# Altium project ldo-1.PrjPcb
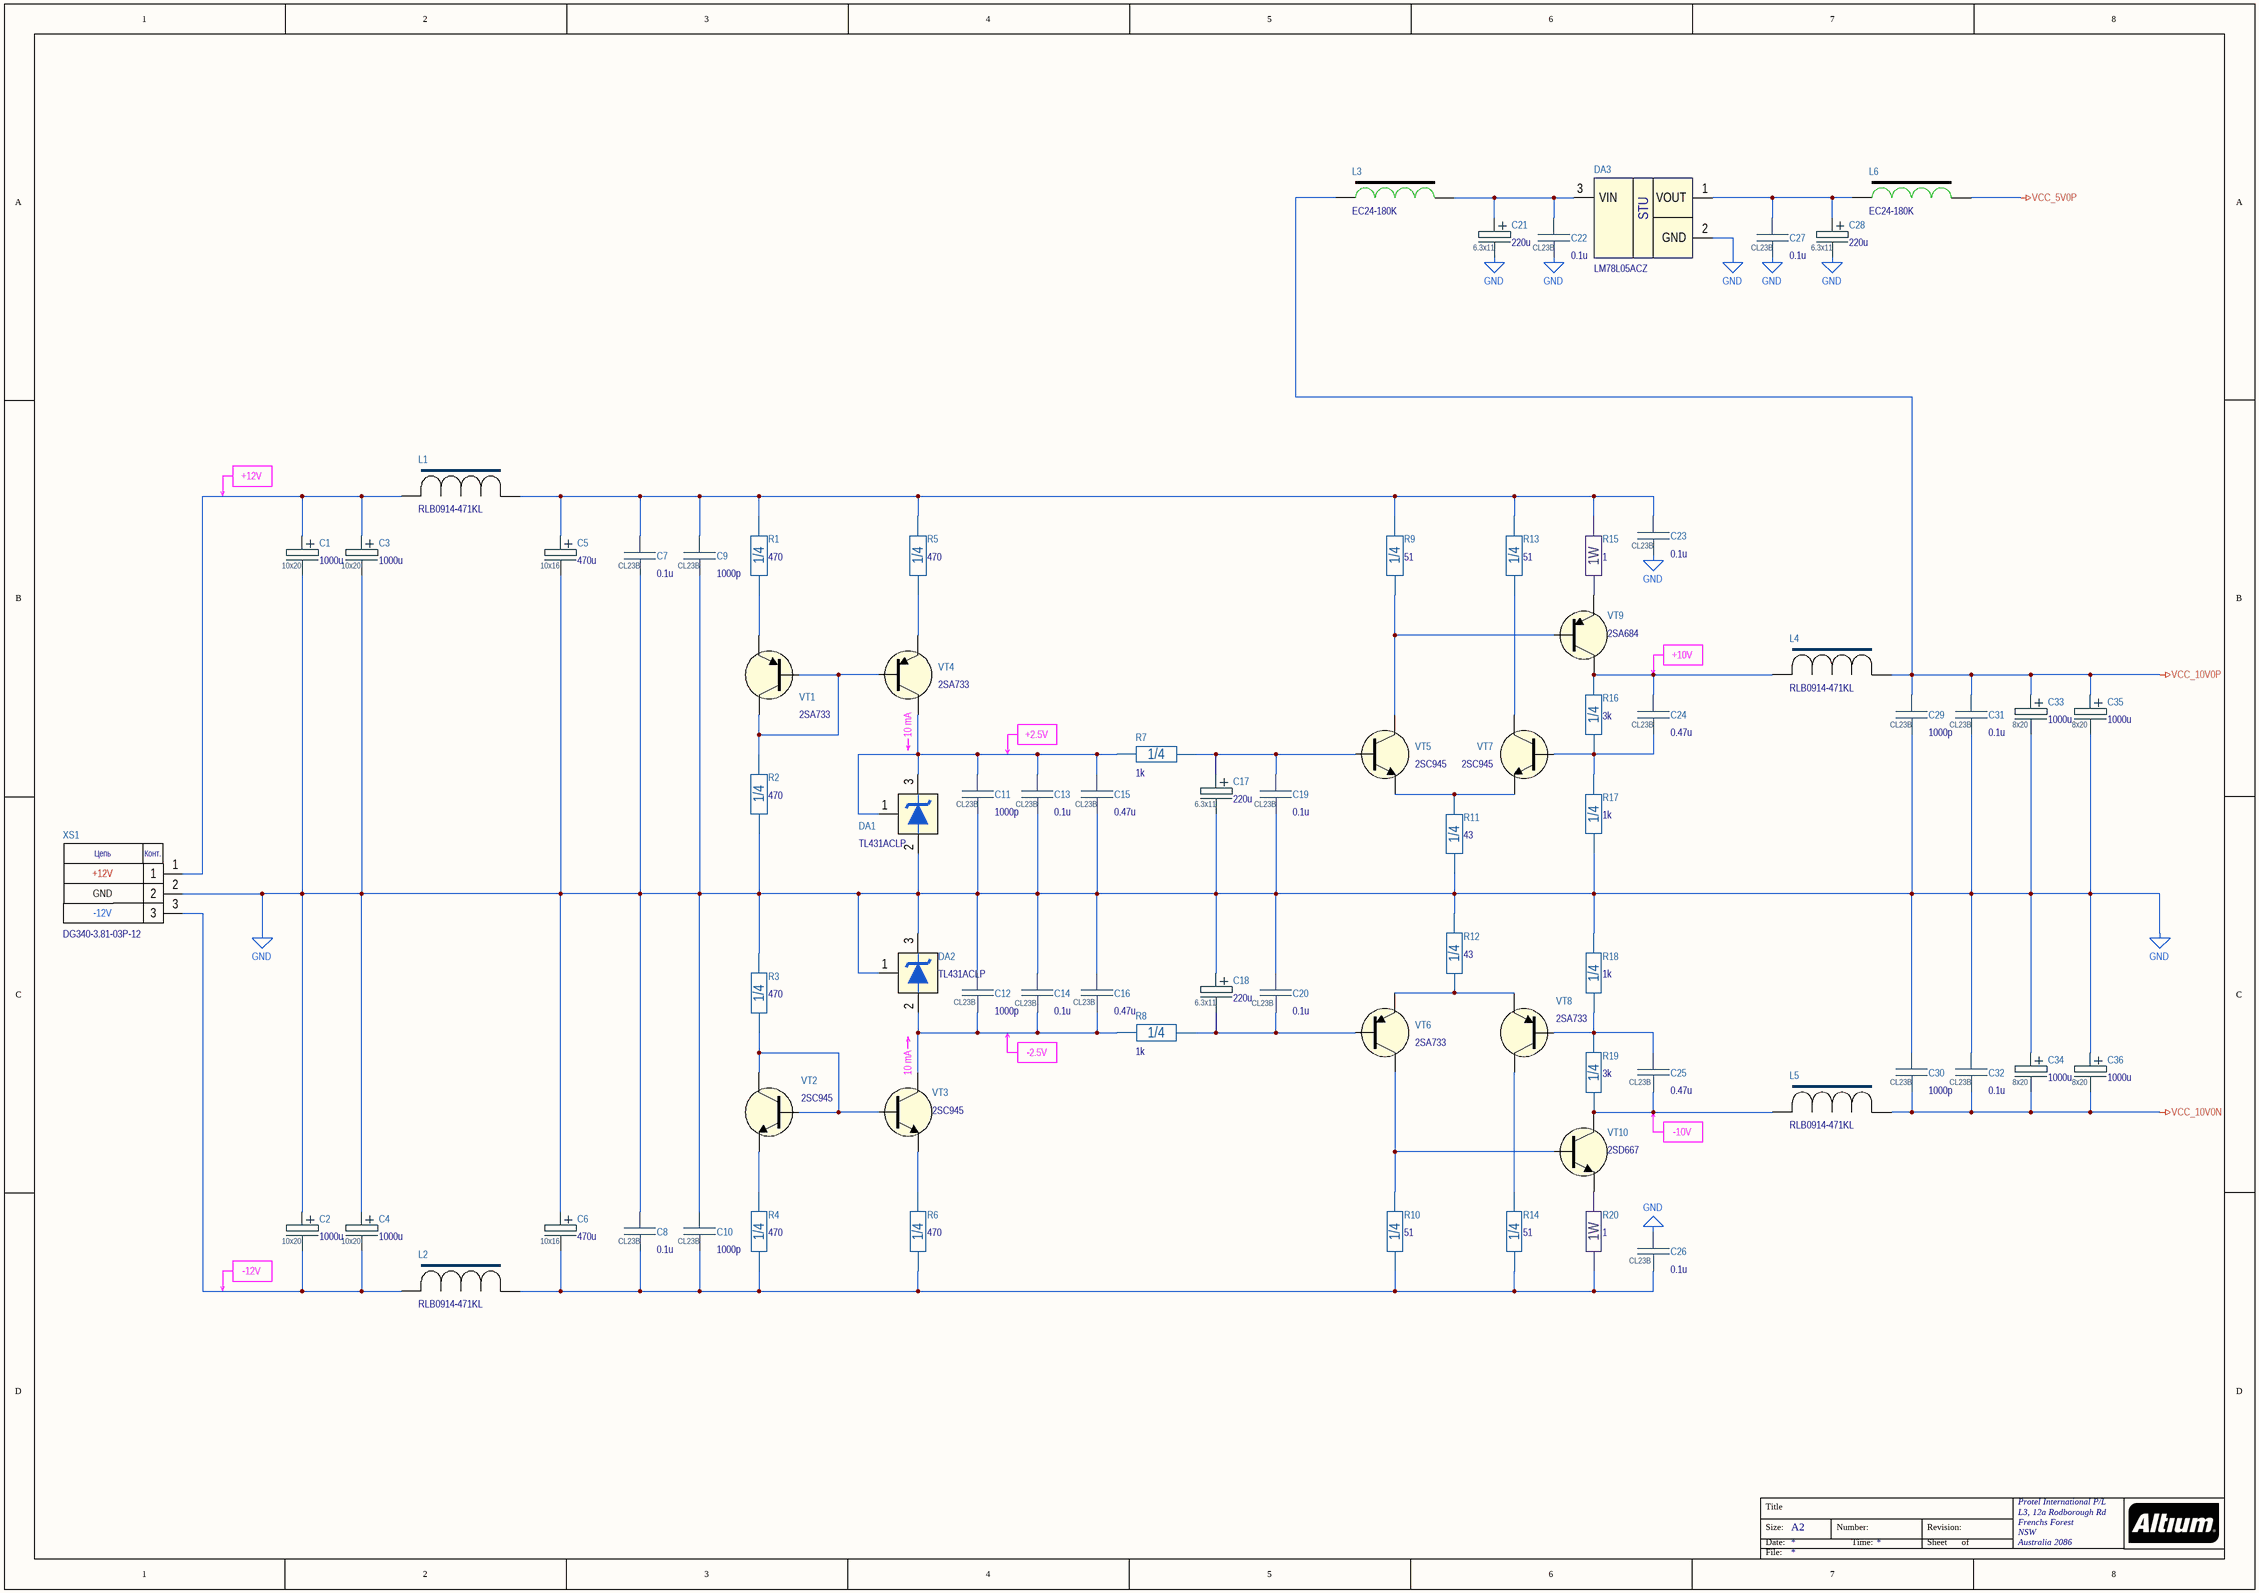
[diagram p0: p1_power_supply_10v.SchDoc]
2 sheets, 191 parts. Net scope: global (net labels, ports and power ports of the same name join across sheets).
Board file: ldo-1.PcbDoc
Sheets:
  p1_power_supply_10v.SchDoc
  p2_regulator.SchDoc

## Sheet p1_power_supply_10v.SchDoc
size A2; Organization: Protel International P/L; Address1: L3, 12a Rodborough Rd; Address2: Frenchs Forest; Address3: NSW; Address4: Australia 2086

### Parts
C1  1000u  Package: 10x20  [ECAP10X21X5_BRW]
C2  1000u  Package: 10x20  [ECAP10X21X5_BRW]
C3  1000u  Package: 10x20  [ECAP10X21X5_BRW]
C4  1000u  Package: 10x20  [ECAP10X21X5_BRW]
C5  470u  Package: 10x16  [ECAP10X17X5_BRW]
C6  470u  Package: 10x16  [ECAP10X17X5_BRW]
C7  0.1u  [CL23B_7.2x2.5]
C8  0.1u  [CL23B_7.2x2.5]
C9  1000p  [CL23B_7.2x2.5]
C10  1000p  [CL23B_7.2x2.5]
C11  1000p  [CL23B_7.2x2.5]
C12  1000p  [CL23B_7.2x2.5]
C13  0.1u  [CL23B_7.2x2.5]
C14  0.1u  [CL23B_7.2x2.5]
C15  0.47u  [CL23B_7.2x3.5]
C16  0.47u  [CL23B_7.2x3.5]
C17  220u  Package: 6.3x11  [ECAP6.3X11X2.5_BRW]
C18  220u  Package: 6.3x11  [ECAP6.3X11X2.5_BRW]
C19  0.1u  [CL23B_7.2x2.5]
C20  0.1u  [CL23B_7.2x2.5]
C21  220u  Package: 6.3x11  [ECAP6.3X11X2.5_BRW]
C22  0.1u  [CL23B_7.2x2.5]
C23  0.1u  [CL23B_7.2x2.5]
C24  0.47u  [CL23B_7.2x3.5]
C25  0.47u  [CL23B_7.2x3.5]
C26  0.1u  [CL23B_7.2x2.5]
C27  0.1u  [CL23B_7.2x2.5]
C28  220u  Package: 6.3x11  [ECAP6.3X11X2.5_BRW]
C29  1000p  [CL23B_7.2x2.5]
C30  1000p  [CL23B_7.2x2.5]
C31  0.1u  [CL23B_7.2x2.5]
C32  0.1u  [CL23B_7.2x2.5]
C33  1000u  Package: 8x20  [ECAP8X20X3.5_BRW]
C34  1000u  Package: 8x20  [ECAP8X20X3.5_BRW]
C35  1000u  Package: 8x20  [ECAP8X20X3.5_BRW]
C36  1000u  Package: 8x20  [ECAP8X20X3.5_BRW]
DA1  TL431ACLP  [TO-92 (VERTICAL,LINE)]
DA2  TL431ACLP  [TO-92 (VERTICAL,LINE)]
DA3  LM78L05ACZ  [TO-92 (VERTICAL,LINE)]
L1  RLB0914-471KL  [RLB0914]
L2  RLB0914-471KL  [RLB0914]
L3  EC24-180K  [EC24_GREEN]
L4  RLB0914-471KL  [RLB0914]
L5  RLB0914-471KL  [RLB0914]
L6  EC24-180K  [EC24_GREEN]
R1  470  Package: 1/4  [CFR-25]
R2  470  Package: 1/4  [CFR-25]
R3  470  Package: 1/4  [CFR-25]
R4  470  Package: 1/4  [CFR-25]
R5  470  Package: 1/4  [CFR-25]
R6  470  Package: 1/4  [CFR-25]
R7  1k  Package: 1/4  [CFR-25]
R8  1k  Package: 1/4  [CFR-25]
R9  51  Package: 1/4  [CFR-25]
R10  51  Package: 1/4  [CFR-25]
R11  43  Package: 1/4  [CFR-25]
R12  43  Package: 1/4  [CFR-25]
R13  51  Package: 1/4  [CFR-25]
R14  51  Package: 1/4  [CFR-25]
R15  1  Package: 1W  [CFR-100]
R16  3k  Package: 1/4  [CFR-25]
R17  1k  Package: 1/4  [CFR-25]
R18  1k  Package: 1/4  [CFR-25]
R19  3k  Package: 1/4  [CFR-25]
R20  1  Package: 1W  [CFR-100]
VT1  2SA733  [TO-92 (VERTICAL,LINE)]
VT2  2SC945  [TO-92 (VERTICAL,LINE)]
VT3  2SC945  [TO-92 (VERTICAL,LINE)]
VT4  2SA733  [TO-92 (VERTICAL,LINE)]
VT5  2SC945  [TO-92 (VERTICAL,LINE)]
VT6  2SA733  [TO-92 (VERTICAL,LINE)]
VT7  2SC945  [TO-92 (VERTICAL,LINE)]
VT8  2SA733  [TO-92 (VERTICAL,LINE)]
VT9  2SA684  [TO-92L (VERTICAL,LINE)]
VT10  2SD667  [TO-92L (VERTICAL,LINE)]
XS1  DG340-3.81-03P-12  [DG340-3.81-03P]

### Nets
GND: C1.2 C2.1 C3.2 C4.1 C5.2 C6.1 C7.2 C8.1 C9.2 C10.1 C11.2 C12.2 C13.2 C14.2 C15.2 C16.2 C17.2 C18.1 C19.2 C20.2 C21.2 C22.2 C23.2 C26.2 C27.2 C28.2 C29.2 C30.1 C31.2 C32.1 C33.2 C34.1 C35.2 C36.1 DA1.2(ANODE) DA2.1(REF) DA2.3(CATHODE) DA3.2(GND) R2.1 R3.1 R11.2 R12.2 R17.2 R18.2 XS1.2
VCC_5V0P: L6.2
VCC_10V0N: C30.2 C32.2 C34.2 C36.2 L5.2
VCC_10V0P: C29.1 C31.1 C33.1 C35.1 L3.1 L4.2
NetC1_1: C1.1 C3.1 L1.1 XS1.1
NetC2_2: C2.2 C4.2 L2.1 XS1.3
NetC5_1: C5.1 C7.1 C9.1 C23.1 L1.2 R1.2 R5.2 R9.2 R13.2 R15.2
NetC6_2: C6.2 C8.2 C10.2 C26.1 L2.2 R4.2 R6.2 R10.2 R14.2 R20.2
NetC11_1: C11.1 C13.1 C15.1 DA1.1(REF) DA1.3(CATHODE) R7.2 VT4.2(C)
NetC12_1: C12.1 C14.1 C16.1 DA2.2(ANODE) R8.2 VT3.2(C)
NetC17_1: C17.1 C19.1 R7.1 VT5.1(B)
NetC18_2: C18.2 C20.1 R8.1 VT6.1(B)
NetC21_1: C21.1 C22.1 DA3.3(VIN) L3.2
NetC24_1: C24.1 L4.1 R16.1 VT9.2(C)
NetC24_2: C24.2 R16.2 R17.1 VT7.1(B)
NetC25_1: C25.1 L5.1 R19.1 VT10.2(C)
NetC25_2: C25.2 R18.1 R19.2 VT8.1(B)
NetC27_1: C27.1 C28.1 DA3.1(VOUT) L6.1
NetR1_1: R1.1 VT1.3(E)
NetR2_2: R2.2 VT1.1(B) VT1.2(C) VT4.1(B)
NetR3_2: R3.2 VT2.1(B) VT2.2(C) VT3.1(B)
NetR4_1: R4.1 VT2.3(E)
NetR5_1: R5.1 VT4.3(E)
NetR6_1: R6.1 VT3.3(E)
NetR9_1: R9.1 VT5.2(C) VT9.3(B)
NetR10_1: R10.1 VT6.2(C) VT10.3(B)
NetR11_1: R11.1 VT5.3(E) VT7.3(E)
NetR12_1: R12.1 VT6.3(E) VT8.3(E)
NetR13_1: R13.1 VT7.2(C)
NetR14_1: R14.1 VT8.2(C)
NetR15_1: R15.1 VT9.1(E)
NetR20_1: R20.1 VT10.1(E)

### Notes on the sheet
- +12V
- +10V
- (near VT4) 10 mA
- +2.5V
- GND
- -12V
- -2.5V
- (near VT3) 10 mA
- -10V
- Title
- Size:
- Date:
- File:
- A2
- Number:
- Time:
- Revision:
- Sheet
- of
- (in symbol DG340-3.81-03P-12) Цепь; Конт.
- (in symbol LM78L05ACZ) STU

### Library data of the parts
C1-C4 = C_ECAP: Aluminium capacitor; Part Number: UVZ1E102MPD; Manufacturer: Nichicon; Tolerance: ± 20 %; Voltage: 25V; Value: 1000u; Value on schem: 1000u
C5 C6 = C_ECAP: Aluminium capacitor; Part Number: UPW1E471MPD; Manufacturer: Nichicon; Tolerance: ± 20 %; Voltage: 25V; Value: 470u; Value on schem: 470u
C7-C16 C19 C20 C22-C27 C29-C32 = CL23B: Box-type metallized polyester film capacitor; Tolerance: ± * %; Voltage: 63V; Dielectric: Polyester; Part Number: *; Manufacturer: *; Package: CL23B
  C7 C8 C13 C14 C19 C20 C22 C23 C26 C27 C31 C32: Value: 0.1u; Value on schem: 0.1u
  C9-C12 C29 C30: Value: 1000p; Value on schem: 1000p
  C15 C16 C24 C25: Value: 0.47u; Value on schem: 0.47u
C17 C18 C21 C28 = C_ECAP: Aluminium capacitor; Part Number: EKZH160ELL221MF11D; Manufacturer: Nichicon; Tolerance: ± 20 %; Voltage: 16V; Value: 220u; Value on schem: 220u
C33-C36 = C_ECAP: Aluminium capacitor; Part Number: UHV1C102MPD6; Manufacturer: Nichicon; Tolerance: ± 20 %; Voltage: 16V; Value: 1000u; Value on schem: 1000u
DA1 DA2 = TL431ACLP: Precision Programmable Reference; Manufacturer: Texas Instruments; Part Number: TL431ACLP; Package: TO-92
DA3 = LM78L05ACZ: 100-mA Fixed Output Linear Regulator; Manufacturer: Texas Instruments; Part Number: LM78L05ACZ; Package: TO-92
L1 L2 L4 L5 = RLB0914: Radial Inductors; Manufacturer: Bourns Inc.; RDC: 1.3 Ohm; SRF Min: 1.8 MHz; Q: 20; Irms  Max: 0.56 A; Isat  Typ: 1.0 A; Inductance @ 100 kHz: 470 µH; Part Number: RLB0914-471KL; Package: 8.7x12mm
L3 L6 = EC24: Axial leaded coated inductors; Manufacturer: 3L Electronic; RDC: 1 Ohm; SRF Min: 15 MHz; Q: 40; Irms  Max: 315 mA; Inductance @ 100 kHz: 18 µH; Part Number: EC24-180K; Package: EC24
R1-R6 = CF25: Resistor 1/4W; Part Number: MFP-25BRD52-470R; Manufacturer: Yageo; Tolerance: ± 0.1 %; Voltage: 250V; Temperature Coefficient: ±20 ppm/°C; Value: 470; Value on schem: 470
R7 R8 R17 R18 = CF25: Resistor 1/4W; Part Number: MFR-25FTF52-10K; Manufacturer: Yageo; Tolerance: ± 1 %; Voltage: 250V; Temperature Coefficient: ±100 ppm/°C; Value: 1k; Value on schem: 1k
R9 R10 R13 R14 = CF25: Resistor 1/4W; Part Number: MFP-25BRD52-51R; Manufacturer: Yageo; Tolerance: ± 0.1 %; Voltage: 250V; Temperature Coefficient: ±20 ppm/°C; Value: 51; Value on schem: 51
R11 R12 = CF25: Resistor 1/4W; Part Number: MFR-25FTF52-43R; Manufacturer: Yageo; Tolerance: ± 1 %; Voltage: 250V; Temperature Coefficient: ±100 ppm/°C; Value: 43; Value on schem: 43
R15 R20 = CF100: Resistor 1W; Part Number: KNP100FB-73-1R; Manufacturer: Yageo; Tolerance: ± 1 %; Voltage: 250V; Temperature Coefficient: ±200 ppm/°C; Value: 1; Value on schem: 1
R16 R19 = CF25: Resistor 1/4W; Part Number: MFR-25FTF52-3K; Manufacturer: Yageo; Tolerance: ± 1 %; Voltage: 250V; Temperature Coefficient: ±100 ppm/°C; Value: 3k; Value on schem: 3k
VT1 VT4 VT6 VT8 = 2SA733: General Purpose p-n-p Transistors; Manufacturer: NEC; Package: TO-92; Part Number: 2SA733
VT2 VT3 VT5 VT7 = 2SC945: General Purpose n-p-n Transistors; Manufacturer: NEC; Package: TO-92; Part Number: 2SC945
VT9 = 2SA684: General Purpose p-n-p Transistors -60V, -1A; Manufacturer: Secos; Package: TO-92L; Part Number: 2SA684
VT10 = 2SD667: General Purpose n-p-n Transistors 120V, 1A; Manufacturer: Secos; Package: TO-92L; Part Number: 2SD667
XS1 = DG340-3.81-03P-12: 3-way screw terminal, pitch 150mils (3.81mm); Manufacturer: DEGSON; Part Number: DG340-3.81-03P-12

## Sheet p2_regulator.SchDoc
size A1; Organization: Protel International P/L; Address1: L3, 12a Rodborough Rd; Address2: Frenchs Forest; Address3: NSW; Address4: Australia 2086
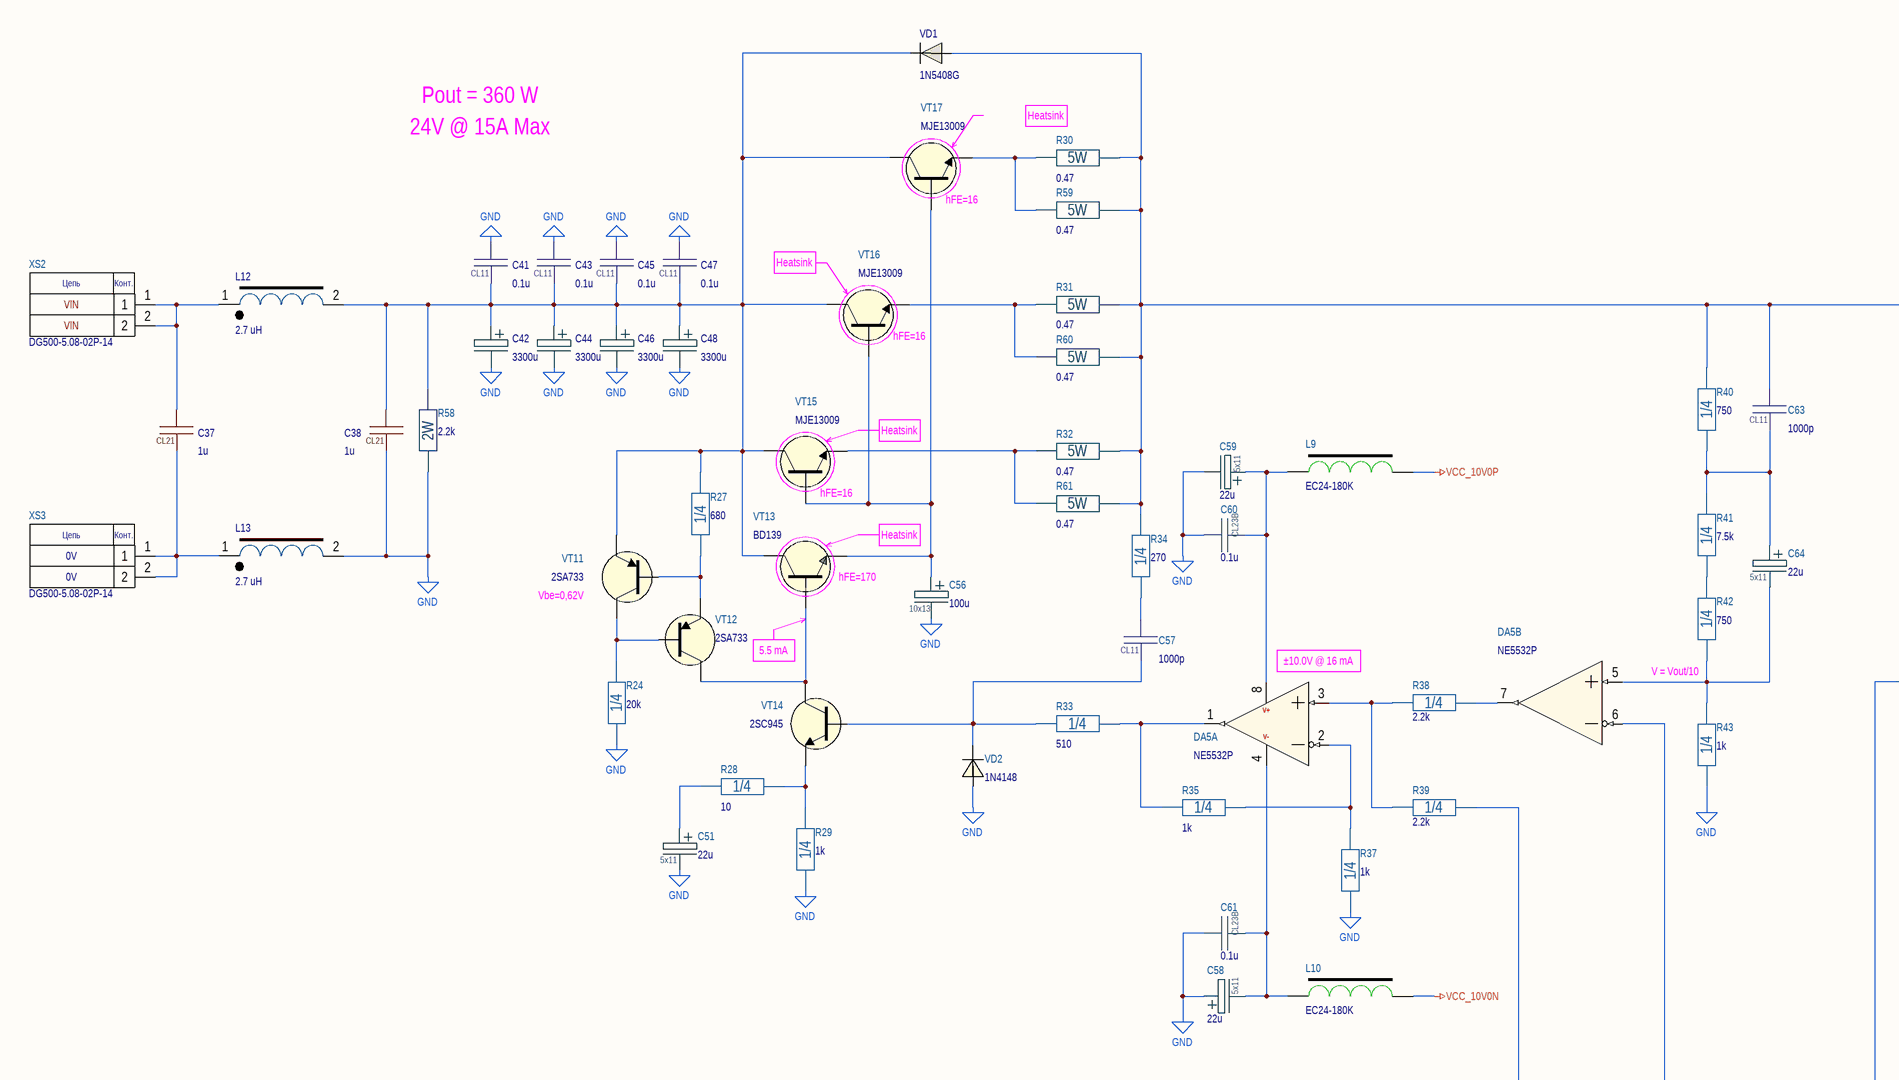
[diagram p1: p2_regulator.SchDoc, top left]
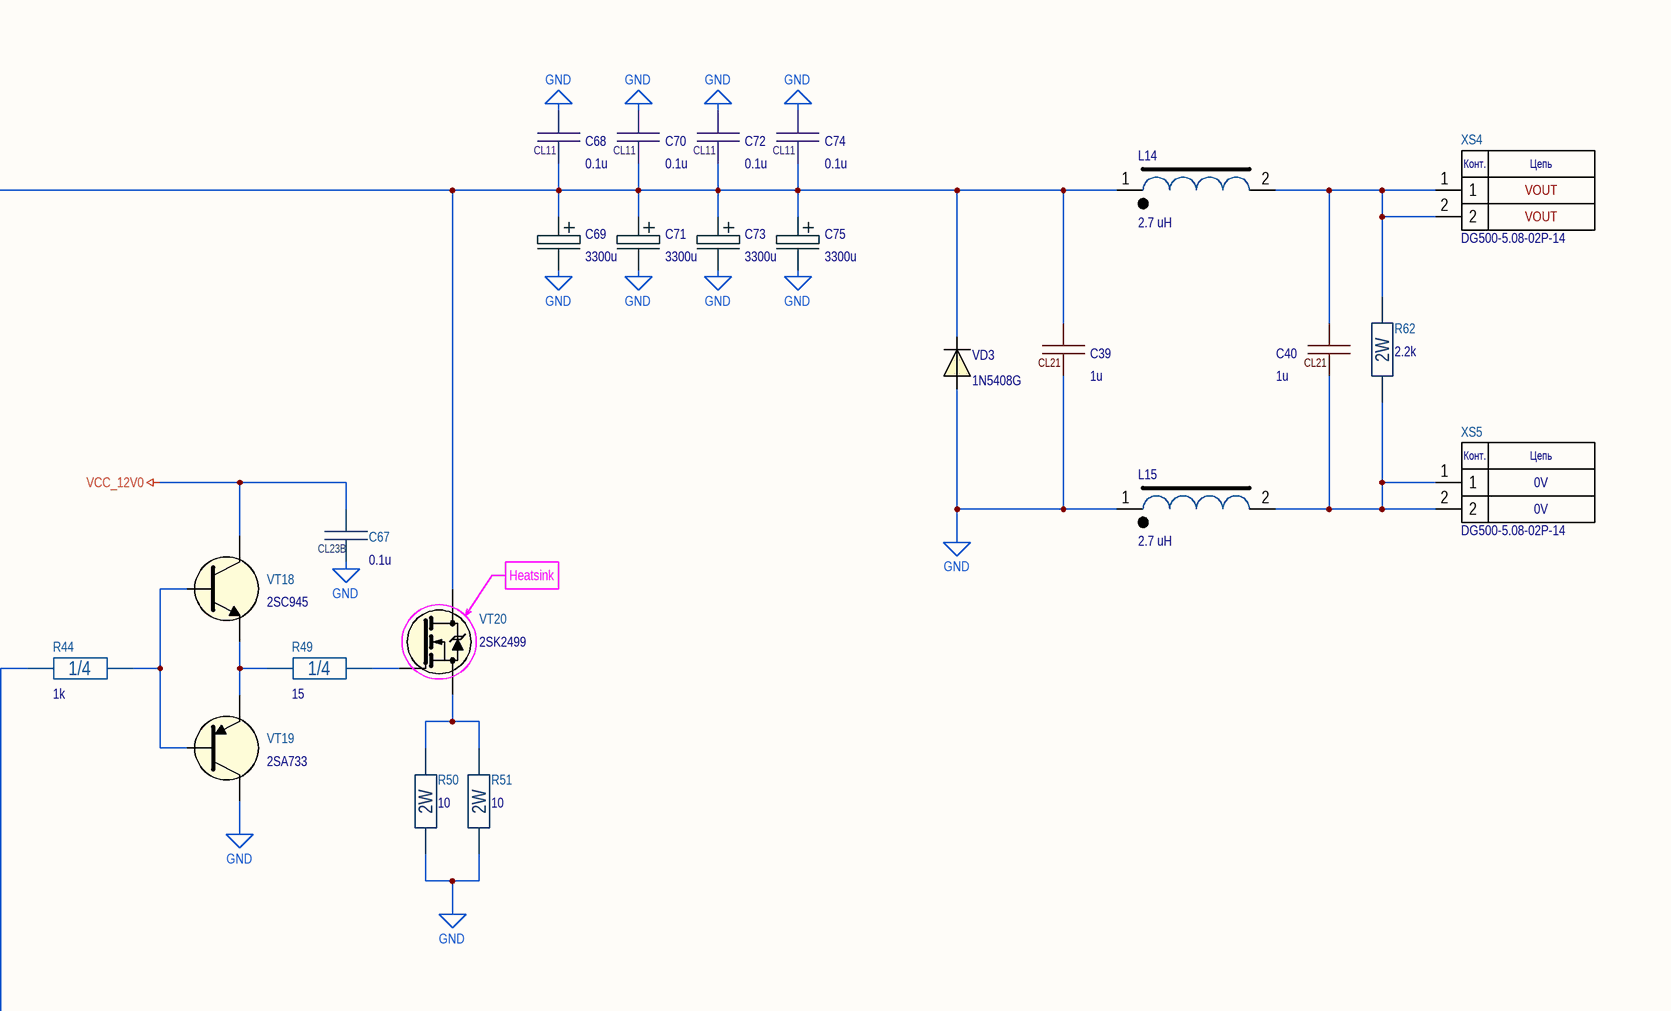
[diagram p2: p2_regulator.SchDoc, top right]
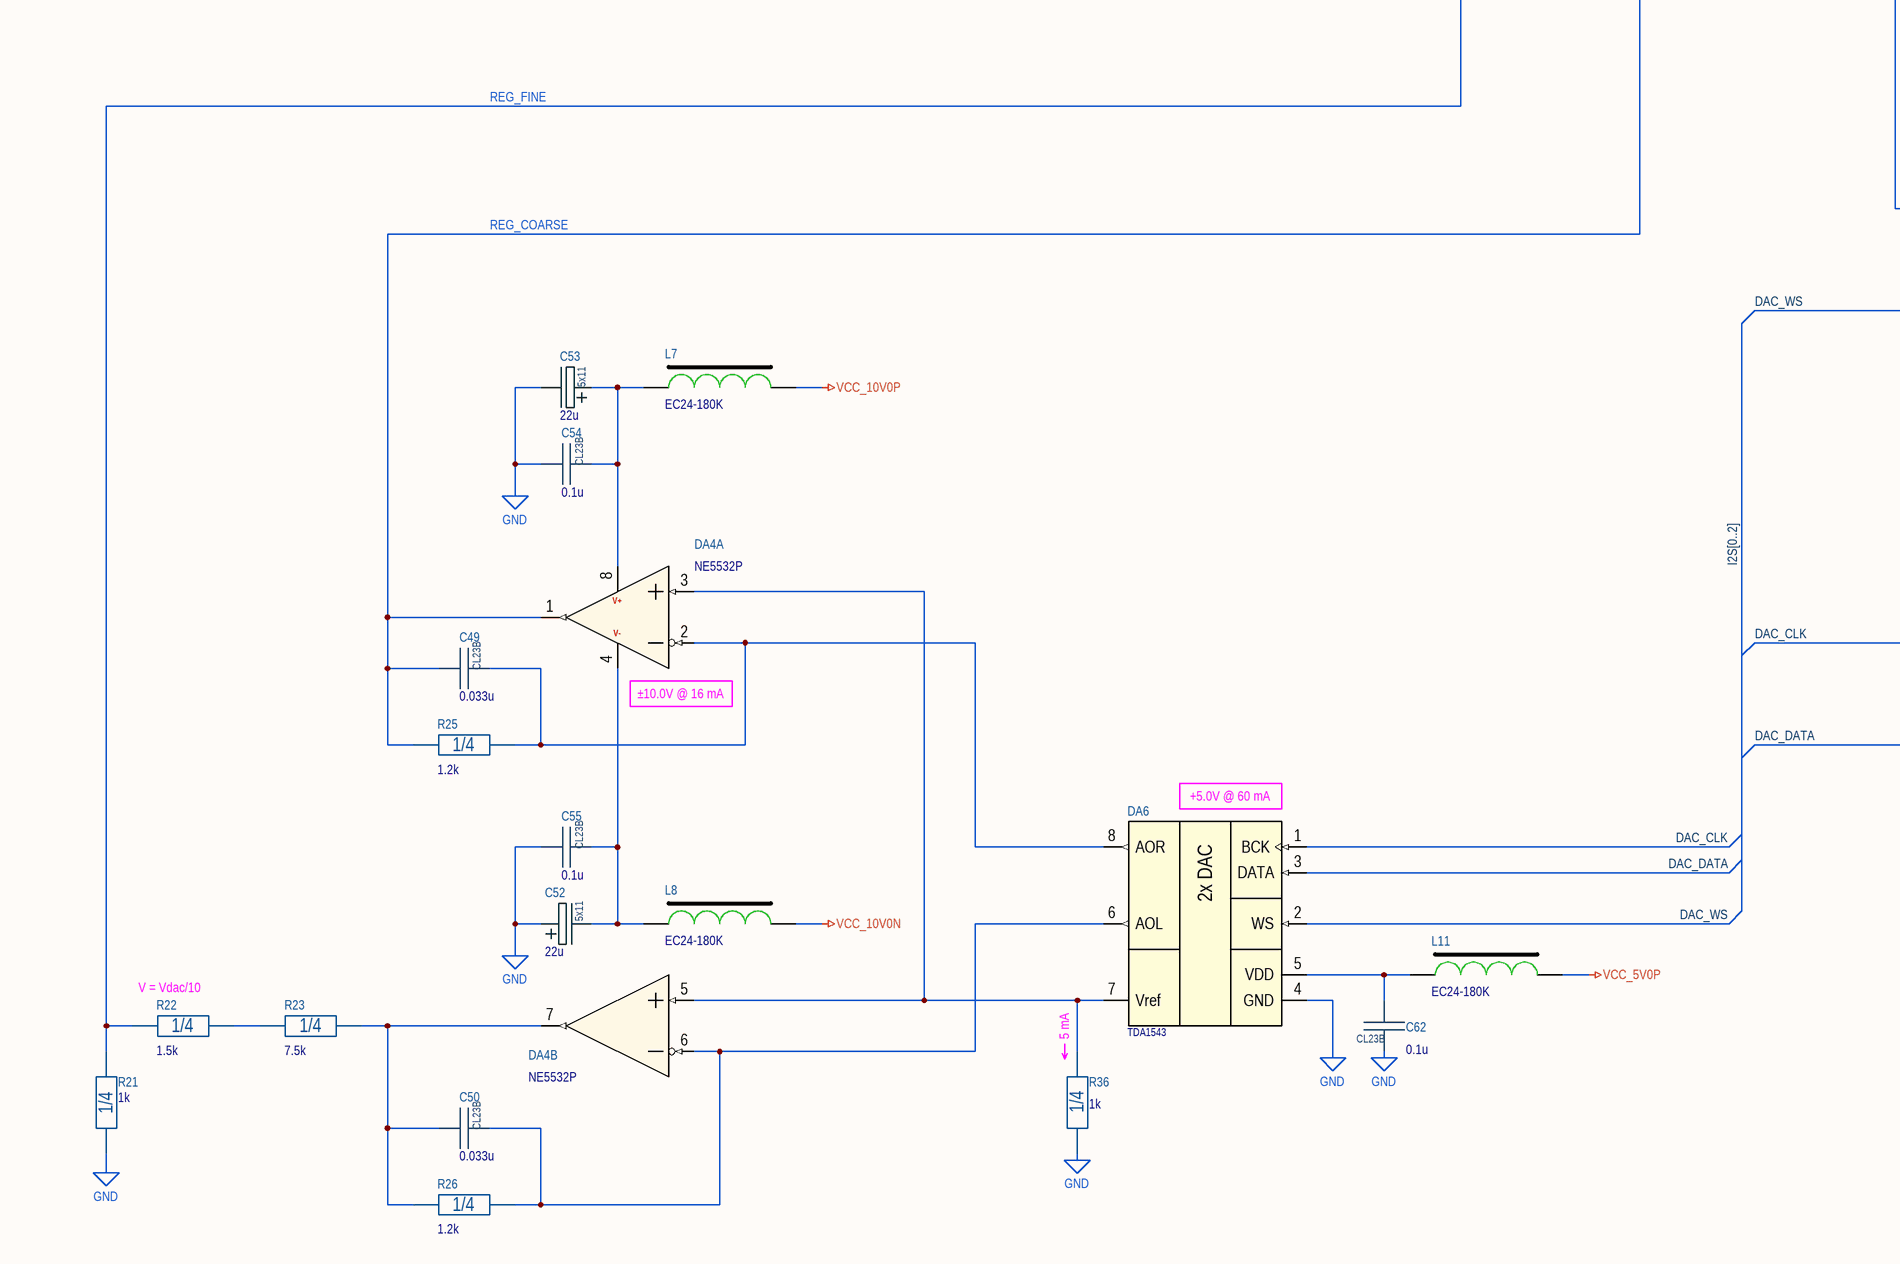
[diagram p3: p2_regulator.SchDoc, bottom left]
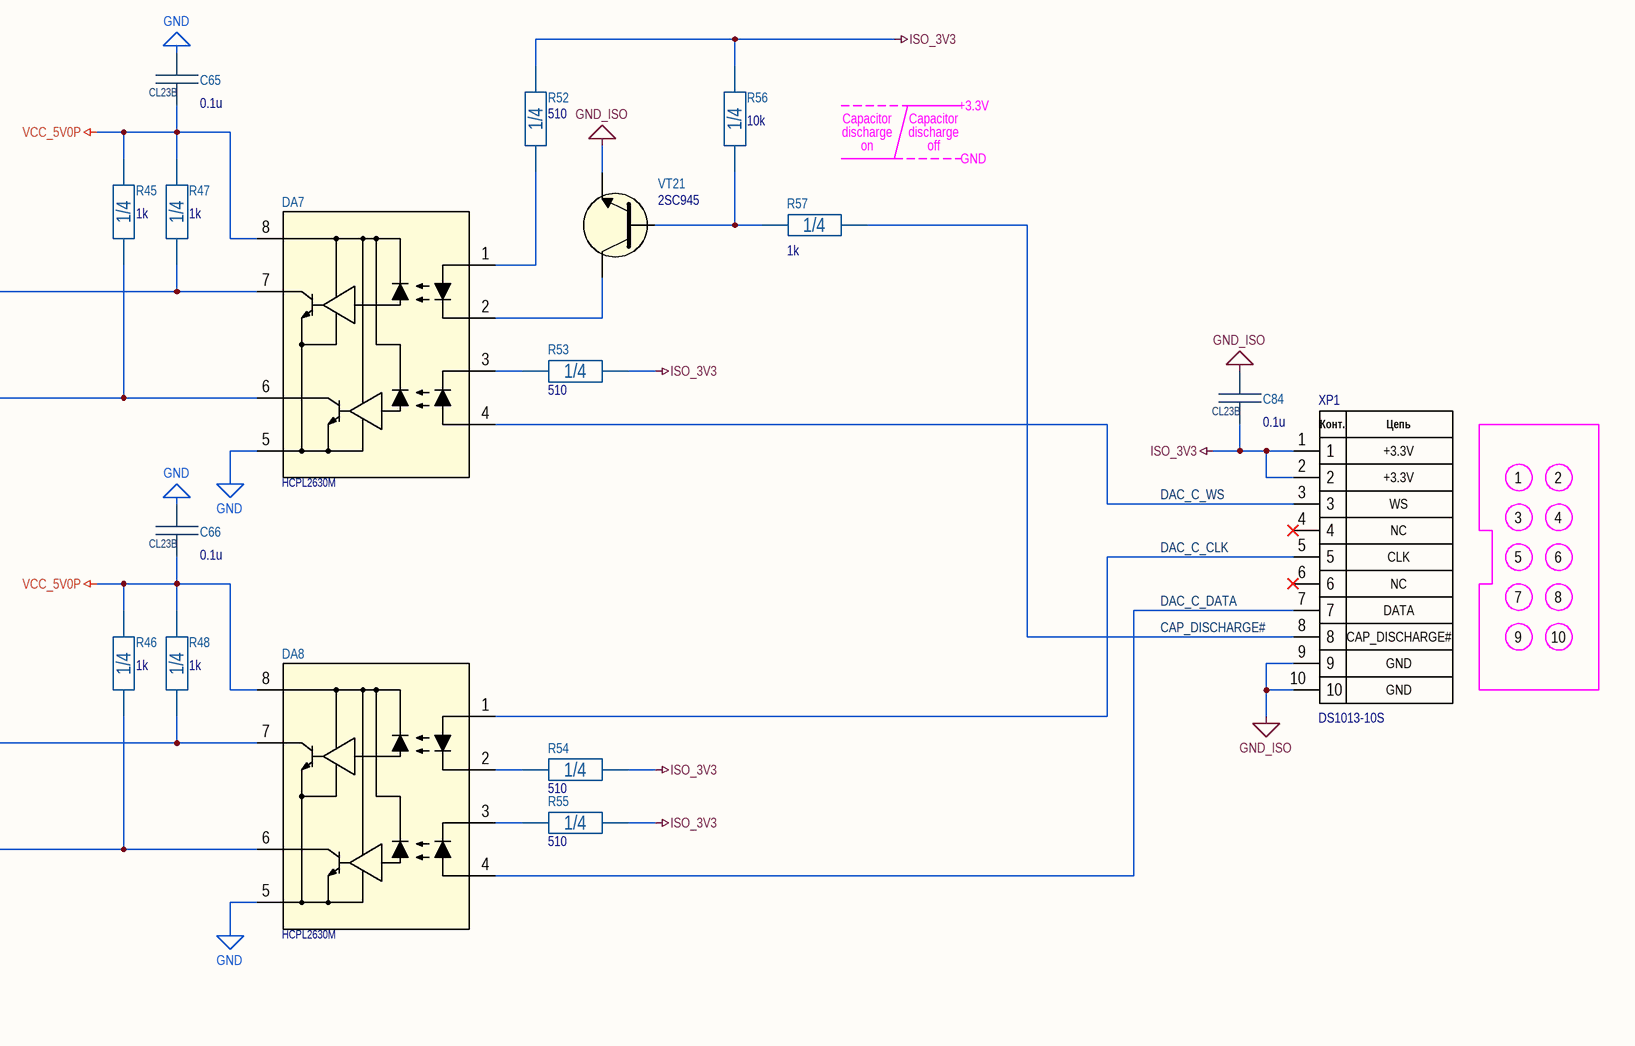
[diagram p4: p2_regulator.SchDoc, bottom right]

### Parts
C37  1u  [CL21_29x13.5x6.5_P27.5]
C38  1u  [CL21_29x13.5x6.5_P27.5]
C39  1u  [CL21_29x13.5x6.5_P27.5]
C40  1u  [CL21_29x13.5x6.5_P27.5]
C41  0.1u  [CL11_11.5x7_P7.5]
C42  3300u  [ECAP16X36X75_BLK]
C43  0.1u  [CL11_11.5x7_P7.5]
C44  3300u  [ECAP16X36X75_BLK]
C45  0.1u  [CL11_11.5x7_P7.5]
C46  3300u  [ECAP16X36X75_BLK]
C47  0.1u  [CL11_11.5x7_P7.5]
C48  3300u  [ECAP16X36X75_BLK]
C49  0.033u  [CL23B_7.2x2.5]
C50  0.033u  [CL23B_7.2x2.5]
C51  22u  Package: 5x11  [ECAP5X11X2.0_BRW]
C52  22u  Package: 5x11  [ECAP5X11X2.0_BRW]
C53  22u  Package: 5x11  [ECAP5X11X2.0_BRW]
C54  0.1u  [CL23B_7.2x2.5]
C55  0.1u  [CL23B_7.2x2.5]
C56  100u  Package: 10x13  [ECAP10X13X5_BRW]
C57  1000p  [CL11_6x3.5_P3.5]
C58  22u  Package: 5x11  [ECAP5X11X2.0_BRW]
C59  22u  Package: 5x11  [ECAP5X11X2.0_BRW]
C60  0.1u  [CL23B_7.2x2.5]
C61  0.1u  [CL23B_7.2x2.5]
C62  0.1u  [CL23B_7.2x2.5]
C63  1000p  [CL11_6x3.5_P3.5]
C64  22u  Package: 5x11  [ECAP5X11X2.0_BRW]
C65  0.1u  [CL23B_7.2x2.5]
C66  0.1u  [CL23B_7.2x2.5]
C67  0.1u  [CL23B_7.2x2.5]
C68  0.1u  [CL11_11.5x7_P7.5]
C69  3300u  [ECAP16X36X75_BLK]
C70  0.1u  [CL11_11.5x7_P7.5]
C71  3300u  [ECAP16X36X75_BLK]
C72  0.1u  [CL11_11.5x7_P7.5]
C73  3300u  [ECAP16X36X75_BLK]
C74  0.1u  [CL11_11.5x7_P7.5]
C75  3300u  [ECAP16X36X75_BLK]
C84  0.1u  [CL23B_7.2x2.5]
DA4  NE5532P  [DIP-8P-M01_with_SO8]  (parts A,B of 2)
DA5  NE5532P  [DIP-8P-M01]  (parts A,B of 2)
DA6  TDA1543  [DIP-8P-M01]
DA7  HCPL2630M  [DIP-8P-M01]
DA8  HCPL2630M  [DIP-8P-M01]
L7  EC24-180K  [EC24_GREEN]
L8  EC24-180K  [EC24_GREEN]
L9  EC24-180K  [EC24_GREEN]
L10  EC24-180K  [EC24_GREEN]
L11  EC24-180K  [EC24_GREEN]
L12  2.7 uH  [CORE_D20_GB]
L13  2.7 uH  [CORE_D20_GB]
L14  2.7 uH  [CORE_D20_GB]
L15  2.7 uH  [CORE_D20_GB]
R21  1k  Package: 1/4  [CFR-25]
R22  1.5k  Package: 1/4  [CFR-25]
R23  7.5k  Package: 1/4  [CFR-25]
R24  20k  Package: 1/4  [CFR-25]
R25  1.2k  Package: 1/4  [CFR-25]
R26  1.2k  Package: 1/4  [CFR-25]
R27  680  Package: 1/4  [CFR-25]
R28  10  Package: 1/4  [CFR-25]
R29  1k  Package: 1/4  [CFR-25]
R30  0.47  Package: 5W  [BPR58]
R31  0.47  Package: 5W  [BPR58]
R32  0.47  Package: 5W  [BPR58]
R33  510  Package: 1/4  [CFR-25]
R34  270  Package: 1/4  [CFR-25]
R35  1k  Package: 1/4  [CFR-25]
R36  1k  Package: 1/4  [CFR-25]
R37  1k  Package: 1/4  [CFR-25]
R38  2.2k  Package: 1/4  [CFR-25]
R39  2.2k  Package: 1/4  [CFR-25]
R40  750  Package: 1/4  [CFR-25]
R41  7.5k  Package: 1/4  [CFR-25]
R42  750  Package: 1/4  [CFR-25]
R43  1k  Package: 1/4  [CFR-25]
R44  1k  Package: 1/4  [CFR-25]
R45  1k  Package: 1/4  [CFR-25]
R46  1k  Package: 1/4  [CFR-25]
R47  1k  Package: 1/4  [CFR-25]
R48  1k  Package: 1/4  [CFR-25]
R49  15  Package: 1/4  [CFR-25]
R50  10  Package: 2W  [CFR-200]
R51  10  Package: 2W  [CFR-200]
R52  510  Package: 1/4  [CFR-25]
R53  510  Package: 1/4  [CFR-25]
R54  510  Package: 1/4  [CFR-25]
R55  510  Package: 1/4  [CFR-25]
R56  10k  Package: 1/4  [CFR-25]
R57  1k  Package: 1/4  [CFR-25]
R58  2.2k  Package: 2W  [CFR-200]
R59  0.47  Package: 5W  [BPR58]
R60  0.47  Package: 5W  [BPR58]
R61  0.47  Package: 5W  [BPR58]
R62  2.2k  Package: 2W  [CFR-200]
VD1  1N5408G  [DO-201AD]
VD2  1N4148  [DO-35 GLASS LIGHT RED]
VD3  1N5408G  [DO-201AD]
VT11  2SA733  [TO-92 (VERTICAL,LINE)]
VT12  2SA733  [TO-92 (VERTICAL,LINE)]
VT13  BD139  [TO-126 (VERTICAL)]
VT14  2SC945  [TO-92 (VERTICAL,LINE)]
VT15  MJE13009  [TO-220_with_TO-247 (VERTICAL)SLOT]
VT16  MJE13009  [TO-220_with_TO-247 (VERTICAL)SLOT]
VT17  MJE13009  [TO-220_with_TO-247 (VERTICAL)SLOT]
VT18  2SC945  [TO-92 (VERTICAL,LINE)]
VT19  2SA733  [TO-92 (VERTICAL,LINE)]
VT20  2SK2499  [TO-220AB-3]
VT21  2SC945  [TO-92 (VERTICAL,LINE)]
XP1  DS1013-10S  [BH-10]
XS2  DG500-5.08-02P-14  [DG500-5.08-02P]
XS3  DG500-5.08-02P-14  [DG500-5.08-02P]
XS4  DG500-5.08-02P-14  [DG500-5.08-02P]
XS5  DG500-5.08-02P-14  [DG500-5.08-02P]

### Nets
GND: C38.1 C39.1 C41.2 C42.2 C43.2 C44.2 C45.2 C46.2 C47.2 C48.2 C51.2 C52.1 C53.2 C54.2 C55.2 C56.2 C58.1 C59.2 C60.2 C61.2 C62.2 C65.1 C66.1 C67.2 C68.2 C69.2 C70.2 C71.2 C72.2 C73.2 C74.2 C75.2 DA6.4(GND) DA7.5(GND) DA8.5(GND) L13.2 L15.1 R21.1 R24.2 R29.2 R36.1 R37.2 R43.2 R50.1 R51.1 R58.1 VD2.2 VD3.2(A) VT19.2(C)
GND_ISO: C84.1 VT21.3(E) XP1.9 XP1.10
ISO_3V3: C84.2 R52.2 R53.1 R54.1 R55.1 R56.1 XP1.1 XP1.2
VCC_5V0P: C65.2 C66.2 DA7.8(VCC) DA8.8(VCC) L11.2 R45.1 R46.1 R47.1 R48.1
VCC_10V0N: L8.2 L10.2
VCC_10V0P: L7.2 L9.2
VCC_12V0: C67.1 VT18.2(C)
CAP_DISCHARGE#: R57.2 XP1.8
DAC_C_CLK: DA8.1(ANODE1) XP1.5
DAC_C_DATA: DA8.4(ANODE2) XP1.7
DAC_C_WS: DA7.4(ANODE2) XP1.3
DAC_CLK: DA6.1(BCK) DA8.7(V01) R48.2
DAC_DATA: DA6.3(DATA) DA8.6(V02) R46.2
DAC_WS: DA6.2(WS) DA7.6(V02) R45.2
REG_COARSE: C49.2 DA4.1(1OUT) DA5.6(2IN-) R25.1
REG_FINE: R21.2 R22.1 R39.2
NetC37_1: C37.1 L13.1 XS3.1 XS3.2
NetC37_2: C37.2 L12.1 XS2.1 XS2.2
NetC38_2: C38.2 C41.1 C42.1 C43.1 C44.1 C45.1 C46.1 C47.1 C48.1 L12.2 R27.1 R58.2 VD1.1(C) VT11.3(E) VT13.2(C) VT15.2(C) VT16.2(C) VT17.2(C)
NetC39_2: C39.2 C63.2 C68.1 C69.1 C70.1 C71.1 C72.1 C73.1 C74.1 C75.1 L14.1 R30.2 R31.2 R32.2 R34.1 R40.1 R59.2 R60.2 R61.2 VD1.2(A) VD3.1(C) VT20.2(D)
NetC40_1: C40.1 L15.2 R62.1 XS5.1 XS5.2
NetC40_2: C40.2 L14.2 R62.2 XS4.1 XS4.2
NetC49_1: C49.1 DA4.2(1IN-) DA6.8(AOR) R25.2
NetC50_1: C50.1 DA4.6(2IN-) DA6.6(AOL) R26.2
NetC50_2: C50.2 DA4.7(2OUT) R23.2 R26.1
NetC51_1: C51.1 R28.2
NetC52_2: C52.2 C55.1 DA4.4(GND) L8.1
NetC53_1: C53.1 C54.1 DA4.8(VCC) L7.1
NetC56_1: C56.1 VT13.3(E) VT15.1(B) VT16.1(B) VT17.1(B)
NetC57_1: C57.1 R33.1 VD2.1 VT14.1(B)
NetC57_2: C57.2 R34.2
NetC58_2: C58.2 C61.1 DA5.4(GND) L10.1
NetC59_1: C59.1 C60.1 DA5.8(VCC) L9.1
NetC62_1: C62.1 DA6.5(VDD) L11.1
NetC63_1: C63.1 C64.1 R40.2 R41.1
NetC64_2: C64.2 DA5.5(2IN+) R42.2 R43.1
NetDA4_3: DA4.3(1IN+) DA4.5(2IN+) DA6.7(Vref) R36.2
NetDA5_1: DA5.1(1OUT) R33.2 R35.1
NetDA5_2: DA5.2(1IN-) R35.2 R37.1
NetDA5_3: DA5.3(1IN+) R38.1 R39.1
NetDA5_7: DA5.7(2OUT) R38.2
NetDA7_1: DA7.1(ANODE1) R52.1
NetDA7_2: DA7.2(CATHODE1) VT21.2(C)
NetDA7_3: DA7.3(CATHODE2) R53.2
NetDA7_7: DA7.7(V01) R44.1 R47.2
NetDA8_2: DA8.2(CATHODE1) R54.2
NetDA8_3: DA8.3(CATHODE2) R55.2
NetR22_2: R22.2 R23.1
NetR24_1: R24.1 VT11.2(C) VT12.1(B)
NetR27_2: R27.2 VT11.1(B) VT12.3(E)
NetR28_1: R28.1 R29.1 VT14.3(E)
NetR30_1: R30.1 R59.1 VT17.3(E)
NetR31_1: R31.1 R60.1 VT16.3(E)
NetR32_1: R32.1 R61.1 VT15.3(E)
NetR41_2: R41.2 R42.1
NetR44_2: R44.2 VT18.1(B) VT19.1(B)
NetR49_1: R49.1 VT20.1(G)
NetR49_2: R49.2 VT18.3(E) VT19.3(E)
NetR50_2: R50.2 R51.2 VT20.3(S)
NetR56_2: R56.2 R57.1 VT21.1(B)
NetVT12_2: VT12.2(C) VT13.1(B) VT14.2(C)

Not connected (* = marked no-connect by the designer): XP1 4* 6*

### Buses and harness runs
bus I2S[0..2]

### Notes on the sheet
- Pout = 360 W
- 24V @ 15A Max
- (near R30) Heatsink
- (near VT17) hFE=16
- Heatsink
- VIN
- (near VT16) hFE=16
- VOUT
- (near VT15) hFE=16
- 0V
- (near VT11) Vbe=0,62V
- (near VT13) hFE=170
- 5.5 mA
- (near DA5) ±10.0V @ 16 mA
- (near R42) V = Vout/10
- Capacitor
- +3.3V
- discharge
- on
- off
- GND
- WS
- NC
- 1
- 3
- 2
- 4
- CLK
- 5
- 7
- 6
- 8
- DATA
- (near XP1) CAP_DISCHARGE#
- 9
- 10
- (near DA4) ±10.0V @ 16 mA
- (near DA6) +5.0V @ 60 mA
- (near R22) V = Vdac/10
- 5 mA
- Title
- Size:
- Date:
- File:
- A1
- Number:
- Time:
- Revision:
- Sheet
- of
- (in symbol BH-10) Конт.; Цепь
- (in symbol DG500-5.08-02P-14) Цепь; Конт.
- (in symbol NE5532P, part A) V+; V-
- (in symbol TDA1543) 2x DAC

### Library data of the parts
C37-C40 = CL21: CL21 Type Metallized Polyester Film Capacitor; Tolerance: ± * %; Voltage: 250V; Value: 1u; Dielectric: Polyester; Value on schem: 1u; Part Number: *; Manufacturer: *; Package: CL21
C41 C43 C45 C47 C68 C70 C72 C74 = CL11: CL11 Type Polyester Film Metal Foil Capacitor-inductive; Tolerance: ± * %; Voltage: 100V; Value: 0.1u; Dielectric: Polyester; Value on schem: 0.1u; Part Number: *; Manufacturer: *; Package: CL11
C42 C44 C46 C48 C69 C71 C73 C75 = C_ECAP: Aluminium capacitor; Part Number: RD1H338M1635MPA; Manufacturer: Samwha; Tolerance: ± 20 %; Voltage: 50V; Value: 3300u; Value on schem: 3300u; Package: 16x36
C49 C50 C54 C55 C60-C62 C65-C67 C84 = CL23B: as C7 on sheet p1_power_supply_10v; Dielectric: Polyester; Part Number: *; Manufacturer: *; Package: CL23B
  C49 C50: Value: 0.033u; Value on schem: 0.033u
  C54 C55 C60-C62 C65-C67 C84: Value: 0.1u; Value on schem: 0.1u
C51-C53 C58 C59 C64 = C_ECAP: Aluminium capacitor; Part Number: UVR1J220MDD; Manufacturer: Nichicon; Tolerance: ± 20 %; Voltage: 63V; Value: 22u; Value on schem: 22u
C56 = C_ECAP: Aluminium capacitor; Manufacturer: Nichicon; Tolerance: ± 20 %; Voltage: 63V; Value: 100u; Value on schem: 100u
C57 C63 = CL11: CL11 Type Polyester Film Metal Foil Capacitor-inductive; Tolerance: ± 5 %; Voltage: 100V; Value: 1000p; Dielectric: Polyester; Value on schem: 1000p; Part Number: *; Manufacturer: *; Package: CL11
DA4 DA5 = NE5532P: DUAL LOW-NOISE OPERATIONAL AMPLIFIERS; Manufacturer: Texas Instruments; Part Number: NE5532P; Package: DIP-8
DA6 = TDA1543: Dual 16-bit DAC, I2S input format; Manufacturer: Philips; Package: DIP-8; Part Number: TDA1543
DA7 DA8 = HCPL2630M: Dual-Channel High-Speed 10 MBit/s Logic Gate Optocouplers; Manufacturer: ON Semiconductor; Package: DIP-8; Part Number: HCPL2630M
L7-L11 = EC24: as L3 on sheet p1_power_supply_10v; Part Number: EC24-180K; Package: EC24
L12-L15 = CORE_D20: Ferrite Core D20.3/12.7/6.35 mm; Core: D20; Value: 2.7 uH
R21 R29 R35 R37 R56 = CF25: as R7 on sheet p1_power_supply_10v
  R21 R29 R35 R37: Value: 1k; Value on schem: 1k
  R56: Value: 10k; Value on schem: 10k
R22 = CF25: Resistor 1/4W; Part Number: MFR-25FTF52-1K5; Manufacturer: Yageo; Tolerance: ± 1 %; Voltage: 250V; Temperature Coefficient: ±100 ppm/°C; Value: 1.5k; Value on schem: 1.5k
R23 R41 = CF25: Resistor 1/4W; Part Number: MFR-25FTF52-7K5; Manufacturer: Yageo; Tolerance: ± 1 %; Voltage: 250V; Temperature Coefficient: ±100 ppm/°C; Value: 7.5k; Value on schem: 7.5k
R24 = CF25: Resistor 1/4W; Part Number: MFR-25FTF52-20K; Manufacturer: Yageo; Tolerance: ± 1 %; Voltage: 250V; Temperature Coefficient: ±100 ppm/°C; Value: 20k; Value on schem: 20k
R25 R26 = CF25: Resistor 1/4W; Part Number: MFR-25FTF52-1K2; Manufacturer: Yageo; Tolerance: ± 1 %; Voltage: 250V; Temperature Coefficient: ±100 ppm/°C; Value: 1.2k; Value on schem: 1.2k
R27 = CF25: Resistor 1/4W; Part Number: MFR-25FTF52-680R; Manufacturer: Yageo; Tolerance: ± 1 %; Voltage: 250V; Temperature Coefficient: ±100 ppm/°C; Value: 680; Value on schem: 680
R28 = CF25: Resistor 1/4W; Part Number: MFR-25FTF52-10R; Manufacturer: Yageo; Tolerance: ± 1 %; Voltage: 250V; Temperature Coefficient: ±100 ppm/°C; Value: 10; Value on schem: 10
R30-R32 R59-R61 = BPR58: Rectangular type metal plate resistors; Part Number: BPR58CR47J; Manufacturer: KOA Speer; Tolerance: ± 5 %; Temperature Coefficient: ±350 /°C; Value: 0.47; Value on schem: 0.47
R33 R52-R55 = CF25: Resistor 1/4W; Part Number: MFR-25FTF52-510R; Manufacturer: Yageo; Tolerance: ± 1 %; Voltage: 250V; Temperature Coefficient: ±100 ppm/°C; Value: 510; Value on schem: 510
R34 = CF25: Resistor 1/4W; Part Number: MFR-25FTF52-270R; Manufacturer: Yageo; Tolerance: ± 1 %; Voltage: 250V; Temperature Coefficient: ±100 ppm/°C; Value: 270; Value on schem: 270
R36 = CF25: Resistor 1/4W; Part Number: MFP-25BRD52-1K; Manufacturer: Yageo; Tolerance: ± 0.1 %; Voltage: 250V; Temperature Coefficient: ±20 ppm/°C; Value: 1k; Value on schem: 1k
R38 R39 = CF25: Resistor 1/4W; Part Number: MFR-25FTF52-2K2; Manufacturer: Yageo; Tolerance: ± 1 %; Voltage: 250V; Temperature Coefficient: ±100 ppm/°C; Value: 2.2k; Value on schem: 2.2k
R40 R42 = CF25: Resistor 1/4W; Part Number: MFR-25FTF52-750R; Manufacturer: Yageo; Tolerance: ± 1 %; Voltage: 250V; Temperature Coefficient: ±100 ppm/°C; Value: 750; Value on schem: 750
R43-R48 R57 = CF25: Resistor 1/4W; Part Number: MFR-25FTF52-1K; Manufacturer: Yageo; Tolerance: ± 1 %; Voltage: 250V; Temperature Coefficient: ±100 ppm/°C; Value: 1k; Value on schem: 1k
R49 = CF25: Resistor 1/4W; Part Number: MFR-25FTF52-15R; Manufacturer: Yageo; Tolerance: ± 1 %; Voltage: 250V; Temperature Coefficient: ±100 ppm/°C; Value: 15; Value on schem: 15
R50 R51 = CF200: Resistor 2W; Part Number: KNP200JB-73-10R; Manufacturer: Yageo; Tolerance: ± 5 %; Voltage: 250V; Temperature Coefficient: ±300 ppm/°C; Value: 10; Value on schem: 10
R58 R62 = CF200: Resistor 2W; Part Number: KNP200JB-73-2K2; Manufacturer: Yageo; Tolerance: ± 5 %; Voltage: 250V; Temperature Coefficient: ±300 ppm/°C; Value: 2.2k; Value on schem: 2.2k
VD1 VD3 = 1N5408G: 3A 1000V Standard Recovery Rectifiers Diode; Manufacturer: ON Semiconductor; Part Number: 1N5408G; Package: DO-201AD
VD2 = 1N4148: High-speed diode; Package: DO-35; Part Number: 1N4148
VT11 VT12 VT19 = 2SA733: as VT1 on sheet p1_power_supply_10v; Package: TO-92; Part Number: 2SA733
VT13 = BD139: General Purpose n-p-n Transistors; Manufacturer: STMicroelectronics; Package: TO-126; Part Number: BD139
VT14 VT18 VT21 = 2SC945: as VT2 on sheet p1_power_supply_10v; Package: TO-92; Part Number: 2SC945
VT15-VT17 = MJE13009: General Purpose n-p-n Transistors 400V, 12A, 100W; Manufacturer: Inchange Semiconductor; Package: TO-220A; Part Number: MJE13009
VT20 = 2SK2499: N-Channel MOSFET, 60V, 50A; Manufacturer: NEC; Part Number: 2SK2499; Package: TO220-3
XP1 = BH-10: 10-pin 2.54 mm Box header elevator type; Manufacturer: Connfly; Part Number: DS1013-10S
XS2-XS5 = DG500-5.08-02P-14: 2-way screw terminal, pitch 200mils (5.08mm); Manufacturer: DEGSON; Part Number: DG500-5.08-02P-14

## Nets that join several sheets
GND: p1_power_supply_10v (45 pins), p2_regulator (49 pins)
VCC_5V0P: p1_power_supply_10v (L6.2), p2_regulator (9 pins)
VCC_10V0N: p1_power_supply_10v (5 pins), p2_regulator (L8.2 L10.2)
VCC_10V0P: p1_power_supply_10v (6 pins), p2_regulator (L7.2 L9.2)